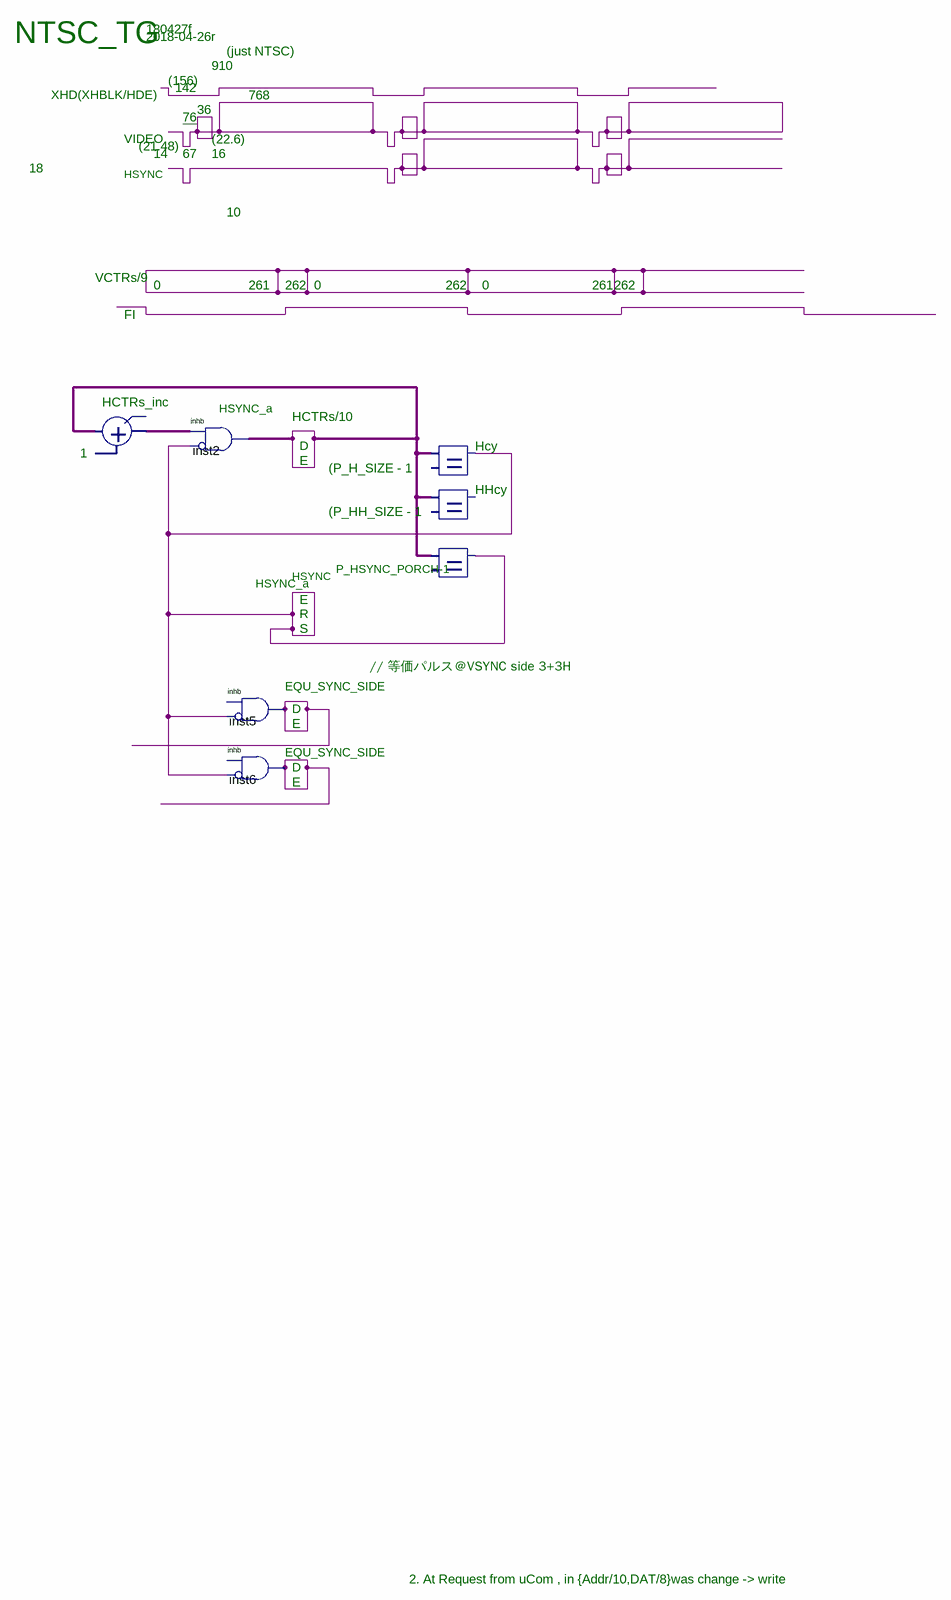
[diagram p0: schematic sheet]
// Quartus schematic NTSC_TG.bdf as structural Verilog: 7 symbols, 0 pins
module NTSC_TG (
);

  wire inst2_1, inst5_1, inst6_1, inst_c;
  wire [7:0] inst4_y, undriven;

  add inst4 (.A(undriven), .Y(inst4_y));  // open: B, cy
  inhb inst2 (.\2 (inst4_y), .\3 (inst_c), .\1 (inst2_1));
  inhb inst5 (.\3 (inst_c), .\1 (inst5_1));  // open: 2
  inhb inst6 (.\3 (inst_c), .\1 (inst6_1));  // open: 2
  cmp inst (.A(undriven), .C(inst_c));  // open: B
  cmp inst1 (.A(undriven));  // open: B, C
  cmp inst3 (.A(undriven), .C(inst_c));  // open: B

  // Notes on the sheet:
  //   NTSC_TG
  //   180427f
  //   2018-04-26r
  //   (just NTSC)
  //   910
  //   (156)
  //   142
  //   XHD(XHBLK/HDE)
  //   768
  //   36
  //   76
  //   VIDEO
  //   (22.6)
  //   (21.48)
  //   14
  //   67
  //   16
  //   18
  //   HSYNC
  //   10
  //   VCTRs/9
  //   0
  //   261
  //   262
  //   0
  //   262
  //   0
  //   261
  //   262
  //   FI
  //   HCTRs_inc
  //   HSYNC_a
  //   HCTRs/10
  //   D
  //   Hcy
  //   1
  //   E
  //   (P_H_SIZE - 1
  //   HHcy
  //   (P_HH_SIZE - 1
  //   P_HSYNC_PORCH-1
  //   HSYNC
  //   HSYNC_a
  //   E
  //   R
  //   S
  //    // 等価パルス＠VSYNC side 3+3H
  //   EQU_SYNC_SIDE
  //   D
  //   E
  //   EQU_SYNC_SIDE
  //   D
  //   E
  //   2. At Request from uCom , in {Addr/10,DAT/8}was change -> write
endmodule
